# Altium schematic sheet P06_BoosterPack Headers.SchDoc
size 301 x 239 mm
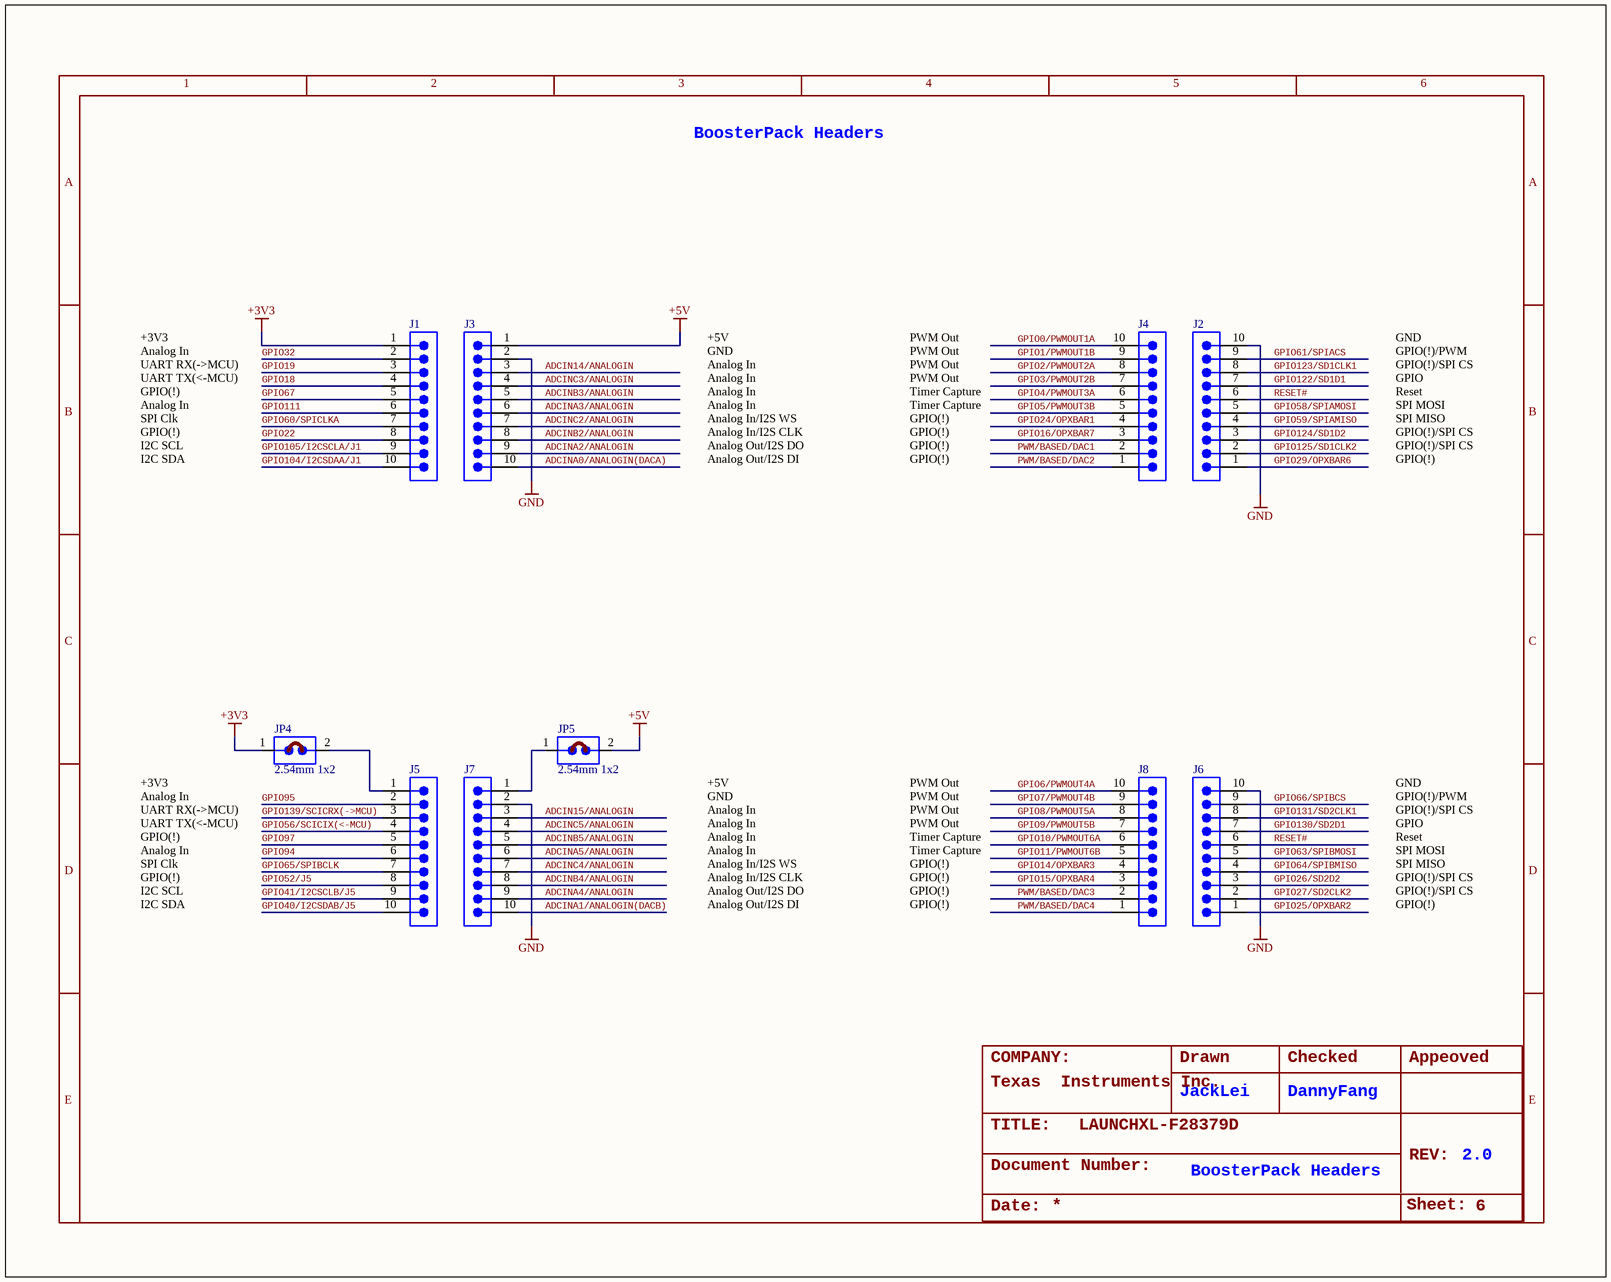
[diagram p0: P06_BoosterPack Headers.SchDoc]

## Parts
J1  FH2543-10GT10  [SOKV2W64P254_1X10_2590X250X850P]  (value not drawn)
J2  FH2543-10GT10  [SOKV2W64P254_1X10_2590X250X850P]  (value not drawn)
J3  FH2543-10GT10  [SOKV2W64P254_1X10_2590X250X850P]  (value not drawn)
J4  FH2543-10GT10  [SOKV2W64P254_1X10_2590X250X850P]  (value not drawn)
J5  FH2543-10GT10  [SOKV2W64P254_1X10_2590X250X850P]  (value not drawn)
J6  FH2543-10GT10  [SOKV2W64P254_1X10_2590X250X850P]  (value not drawn)
J7  FH2543-10GT10  [SOKV2W64P254_1X10_2590X250X850P]  (value not drawn)
J8  FH2543-10GT10  [SOKV2W64P254_1X10_2590X250X850P]  (value not drawn)
JP4  value 2.54mm 1x2  [HDRV2W64P254_1X2_508X250X850P]  (hidden comment: P6E02A-602530-B1)
JP5  value 2.54mm 1x2  [HDRV2W64P254_1X2_508X250X850P]  (hidden comment: P6E02A-602530-B1)
U$12  ROY_JUMPER  [ROY_JUMPER]  (value not drawn)
U$13  ROY_JUMPER  [ROY_JUMPER]  (value not drawn)

## Nets
+3V3: J1.1 JP4.1
+5V: J3.1 JP5.2
GND: J2.10 J3.2 J6.10 J7.2
ADCIN14/ANALOGIN: J3.3
ADCIN15/ANALOGIN: J7.3
ADCINA0/ANALOGIN(DACA): J3.10
ADCINA1/ANALOGIN(DACB): J7.10
ADCINA2/ANALOGIN: J3.9
ADCINA3/ANALOGIN: J3.6
ADCINA4/ANALOGIN: J7.9
ADCINA5/ANALOGIN: J7.6
ADCINB2/ANALOGIN: J3.8
ADCINB3/ANALOGIN: J3.5
ADCINB4/ANALOGIN: J7.8
ADCINB5/ANALOGIN: J7.5
ADCINC2/ANALOGIN: J3.7
ADCINC3/ANALOGIN: J3.4
ADCINC4/ANALOGIN: J7.7
ADCINC5/ANALOGIN: J7.4
GPIO0/PWMOUT1A: J4.10
GPIO1/PWMOUT1B: J4.9
GPIO2/PWMOUT2A: J4.8
GPIO3/PWMOUT2B: J4.7
GPIO4/PWMOUT3A: J4.6
GPIO5/PWMOUT3B: J4.5
GPIO6/PWMOUT4A: J8.10
GPIO7/PWMOUT4B: J8.9
GPIO8/PWMOUT5A: J8.8
GPIO9/PWMOUT5B: J8.7
GPIO10/PWMOUT6A: J8.6
GPIO11/PWMOUT6B: J8.5
GPIO14/OPXBAR3: J8.4
GPIO15/OPXBAR4: J8.3
GPIO16/OPXBAR7: J4.3
GPIO18: J1.4
GPIO19: J1.3
GPIO22: J1.8
GPIO24/OPXBAR1: J4.4
GPIO25/OPXBAR2: J6.1
GPIO26/SD2D2: J6.3
GPIO27/SD2CLK2: J6.2
GPIO29/OPXBAR6: J2.1
GPIO32: J1.2
GPIO40/I2CSDAB/J5: J5.10
GPIO41/I2CSCLB/J5: J5.9
GPIO52/J5: J5.8
GPIO56/SCICIX(<-MCU): J5.4
GPIO58/SPIAMOSI: J2.5
GPIO59/SPIAMISO: J2.4
GPIO60/SPICLKA: J1.7
GPIO61/SPIACS: J2.9
GPIO63/SPIBMOSI: J6.5
GPIO64/SPIBMISO: J6.4
GPIO65/SPIBCLK: J5.7
GPIO66/SPIBCS: J6.9
GPIO67: J1.5
GPIO94: J5.6
GPIO95: J5.2
GPIO97: J5.5
GPIO104/I2CSDAA/J1: J1.10
GPIO105/I2CSCLA/J1: J1.9
GPIO111: J1.6
GPIO122/SD1D1: J2.7
GPIO123/SD1CLK1: J2.8
GPIO124/SD1D2: J2.3
GPIO125/SD1CLK2: J2.2
GPIO130/SD2D1: J6.7
GPIO131/SD2CLK1: J6.8
GPIO139/SCICRX(->MCU): J5.3
PWM/BASED/DAC1: J4.2
PWM/BASED/DAC2: J4.1
PWM/BASED/DAC3: J8.2
PWM/BASED/DAC4: J8.1
RESET#: J2.6 J6.6
NetJ5_1: J5.1 JP4.2
NetJ7_1: J7.1 JP5.1

## Notes on the sheet
- BoosterPack Headers
- +3V3
- Analog In
- +5V
- GND
- PWM Out
- GPIO(!)/PWM
- UART RX(->MCU)
- UART TX(<-MCU)
- GPIO(!)
- SPI Clk
- Analog In/I2S WS
- Timer Capture
- GPIO(!)/SPI CS
- GPIO
- Reset
- SPI MOSI
- SPI MISO
- I2C SCL
- I2C SDA
- Analog In/I2S CLK
- Analog Out/I2S DO
- Analog Out/I2S DI
- COMPANY:
- Texas
  Instruments Inc.
- JackLei
- Drawn
- Checked
- DannyFang
- Appeoved
- TITLE:
- Document Number:
- LAUNCHXL-F28379D
- REV:
- 2.0
- Date:
- Sheet:
- 6
- 1
- 2
- 3
- 4
- 5
- A
- B
- C
- D
- E

## Library data of the parts
J1-J8 = 1009002200006: Connector,Pin Socket,Straight,Female,1x10Pin,2.54MM pitch,8.5,3.2,Gold Flash 1u,black,DIP; Manufacturer: MTCONN; Value: 2.54mm 1x10; Embest PN: 1009002200006; Part Type: Pin Socket; Manufacturer Part Number: FH2543-10GT10
JP4 JP5 = 1009001200003: Connector,Pin Header,Straight,Male,1x2Pin,2.54MM pitch,6.00,3.00,Gold Flash 1u, black,DIP,alt_code:15071705; Manufacturer: CHIN-BAN; Embest PN: 1009001200003; Part Type: Pin Header; Manufacturer Part Number: P6E02A-602530-B1